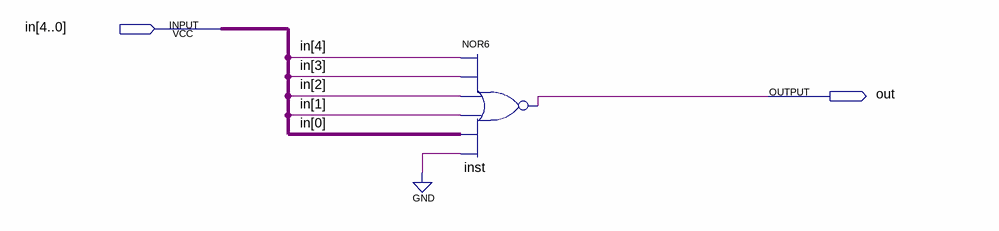
[diagram p0: schematic sheet]
// Quartus schematic nor5para1.bdf as structural Verilog: 1 symbols, 2 pins
module nor5para1 (
  input  [4:0] in,
  output out
);

  nor inst (out, in[4], in[3], in[2], in[1], in[0], 1'b0);
endmodule
